# EAGLE design Driver Board (EAGLE 8.7.1)
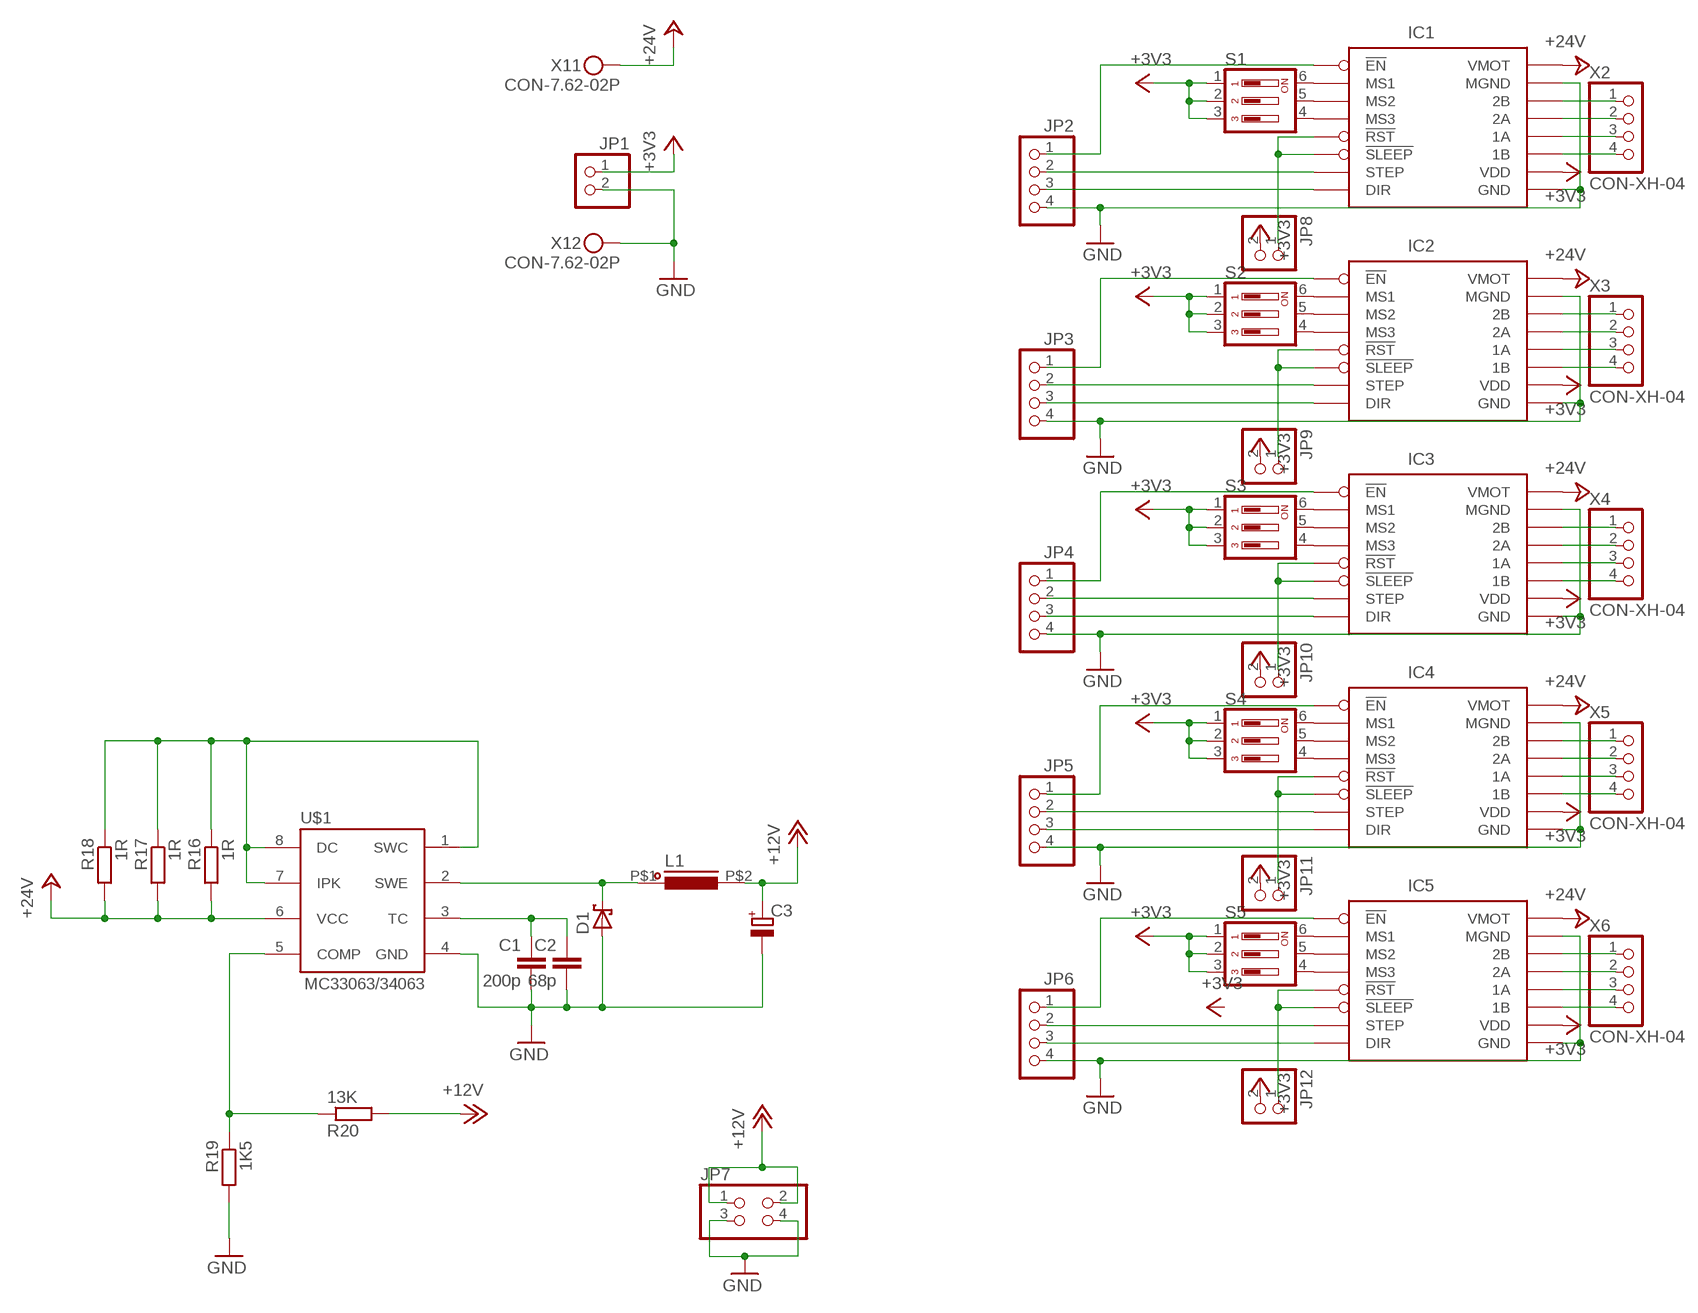
[diagram p0: schematic, sheet 1]

## Parts
C1  200p  CAP_0805  [C0805]
C2  68p  CAP_0805  [C0805]
C3  CAP-POL_E3.5-8  [E3,5-8]
D1  DIODE-SH_SMA  [DO214AC]
IC1  STEP-DRV  [DRV-BRK]
IC2  STEP-DRV  [DRV-BRK]
IC3  STEP-DRV  [DRV-BRK]
IC4  STEP-DRV  [DRV-BRK]
IC5  STEP-DRV  [DRV-BRK]
JP1  PINHD-1X2  [1X02]
JP2  PINHD-1X4  [1X04]
JP3  PINHD-1X4  [1X04]
JP4  PINHD-1X4  [1X04]
JP5  PINHD-1X4  [1X04]
JP6  PINHD-1X4  [1X04]
JP7  PINHD-2X2  [2X02]
JP8  PINHD-1X2  [1X02]
JP9  PINHD-1X2  [1X02]
JP10  PINHD-1X2  [1X02]
JP11  PINHD-1X2  [1X02]
JP12  PINHD-1X2  [1X02]
L1  INDUCTORCW68  [CW68]
R16  1R  R_0805  [R0805]
R17  1R  R_0805  [R0805]
R18  1R  R_0805  [R0805]
R19  1K5  R_0805  [R0805]
R20  13K  R_0805  [R0805]
S1  SW-DIP03S  [DIP03YL]
S2  SW-DIP03S  [DIP03YL]
S3  SW-DIP03S  [DIP03YL]
S4  SW-DIP03S  [DIP03YL]
S5  SW-DIP03S  [DIP03YL]
U$1  MC33063/MC34063P  [DIL08]
X1  CON-7.62-02P  [KF25C-7.62-02P-13]
X2  CON-XH-04  [XH-04]
X3  CON-XH-04  [XH-04]
X4  CON-XH-04  [XH-04]
X5  CON-XH-04  [XH-04]
X6  CON-XH-04  [XH-04]

## Nets
+3V3: IC1.P$10(VDD) IC2.P$10(VDD) IC3.P$10(VDD) IC4.P$10(VDD) IC5.P$10(VDD) JP1.1 JP8.2 JP9.2 JP10.2 JP11.2 JP12.2 S1.1 S1.2 S1.3 S2.1 S2.2 S2.3 S3.1 S3.2 S3.3 S4.1 S4.2 S4.3 S5.1 S5.2 S5.3
+12V: C3.+ JP7.1 JP7.2 L1.P$2 R20.2
+24V: IC1.P$16(VMOT) IC2.P$16(VMOT) IC3.P$16(VMOT) IC4.P$16(VMOT) IC5.P$16(VMOT) R16.2 R17.2 R18.2 U$1.6(VCC) X1.P$1
GND: C1.2 C2.2 C3.- D1.A IC1.P$9(GND) IC1.P$15(MGND) IC2.P$9(GND) IC2.P$15(MGND) IC3.P$9(GND) IC3.P$15(MGND) IC4.P$9(GND) IC4.P$15(MGND) IC5.P$9(GND) IC5.P$15(MGND) JP1.2 JP2.4 JP3.4 JP4.4 JP5.4 JP6.4 JP7.3 JP7.4 R19.2 U$1.4(GND) X1.P$2
N$1: IC1.P$1(!EN) JP2.1
N$2: IC1.P$7(STEP) JP2.2
N$3: IC1.P$8(DIR) JP2.3
N$4: IC1.P$14(2B) X2.1
N$5: IC2.P$8(DIR) JP3.3
N$6: IC2.P$7(STEP) JP3.2
N$7: IC2.P$1(!EN) JP3.1
N$8: IC1.P$13(2A) X2.2
N$9: IC3.P$8(DIR) JP4.3
N$10: IC3.P$7(STEP) JP4.2
N$11: IC3.P$1(!EN) JP4.1
N$12: IC1.P$12(1A) X2.3
N$13: IC1.P$11(1B) X2.4
N$14: IC4.P$8(DIR) JP5.3
N$15: IC4.P$7(STEP) JP5.2
N$16: IC4.P$1(!EN) JP5.1
N$17: IC2.P$14(2B) X3.1
N$18: IC5.P$8(DIR) JP6.3
N$19: IC5.P$7(STEP) JP6.2
N$20: IC5.P$1(!EN) JP6.1
N$21: IC2.P$13(2A) X3.2
N$22: IC2.P$12(1A) X3.3
N$23: IC2.P$11(1B) X3.4
N$24: IC3.P$14(2B) X4.1
N$25: IC3.P$13(2A) X4.2
N$26: IC3.P$12(1A) X4.3
N$27: IC3.P$11(1B) X4.4
N$28: IC4.P$14(2B) X5.1
N$29: IC4.P$13(2A) X5.2
N$30: IC4.P$12(1A) X5.3
N$31: IC4.P$11(1B) X5.4
N$32: IC5.P$14(2B) X6.1
N$33: IC5.P$13(2A) X6.2
N$34: IC5.P$12(1A) X6.3
N$35: IC5.P$11(1B) X6.4
N$36: IC1.P$4(MS3) S1.4
N$37: IC1.P$3(MS2) S1.5
N$38: IC1.P$2(MS1) S1.6
N$39: IC5.P$5(!RST) IC5.P$6(!SLEEP) JP12.1
N$40: IC4.P$5(!RST) IC4.P$6(!SLEEP) JP11.1
N$41: IC3.P$5(!RST) IC3.P$6(!SLEEP) JP10.1
N$42: IC2.P$5(!RST) IC2.P$6(!SLEEP) JP9.1
N$43: IC1.P$5(!RST) IC1.P$6(!SLEEP) JP8.1
N$44: IC2.P$4(MS3) S2.4
N$45: IC2.P$3(MS2) S2.5
N$46: IC2.P$2(MS1) S2.6
N$47: IC3.P$4(MS3) S3.4
N$48: IC3.P$3(MS2) S3.5
N$49: IC3.P$2(MS1) S3.6
N$50: IC4.P$4(MS3) S4.4
N$51: C1.1 C2.1 U$1.3(TC)
N$52: R16.1 R17.1 R18.1 U$1.1(SWC) U$1.7(IPK) U$1.8(DC)
N$53: IC4.P$3(MS2) S4.5
N$54: D1.C L1.P$1 U$1.2(SWE)
N$55: R19.1 R20.1 U$1.5(COMP)
N$56: IC4.P$2(MS1) S4.6
N$57: IC5.P$4(MS3) S5.4
N$58: IC5.P$3(MS2) S5.5
N$59: IC5.P$2(MS1) S5.6

## Library data of the parts
C1 C2 = Namenlos:CAP_
C3 = Namenlos:CAP-POL_
D1 = Namenlos:DIODE-SH_
IC1-IC5 = Namenlos:STEP-DRV
JP1 JP8-JP12 = pinhead:PINHD-1X2: PIN HEADER
JP2-JP6 = pinhead:PINHD-1X4: PIN HEADER
JP7 = pinhead:PINHD-2X2: PIN HEADER
L1 = Namenlos:INDUCTOR
R16-R20 = Namenlos:R_
S1-S5 = Namenlos:SW-DIP03S: DIL/CODE SWITCH; OC_FARNELL: unknown; OC_NEWARK: unknown
U$1 = adafruit:MC33063/MC34063: MC33063 and MC34063 Basic DC/DC converter with internal power-NPN transistor, 100KHz, 1.5A peak switch current. 3-40 input/output.
X1 = Namenlos:CON-7.62-02P
X2-X6 = Namenlos:CON-XH-04

## Board
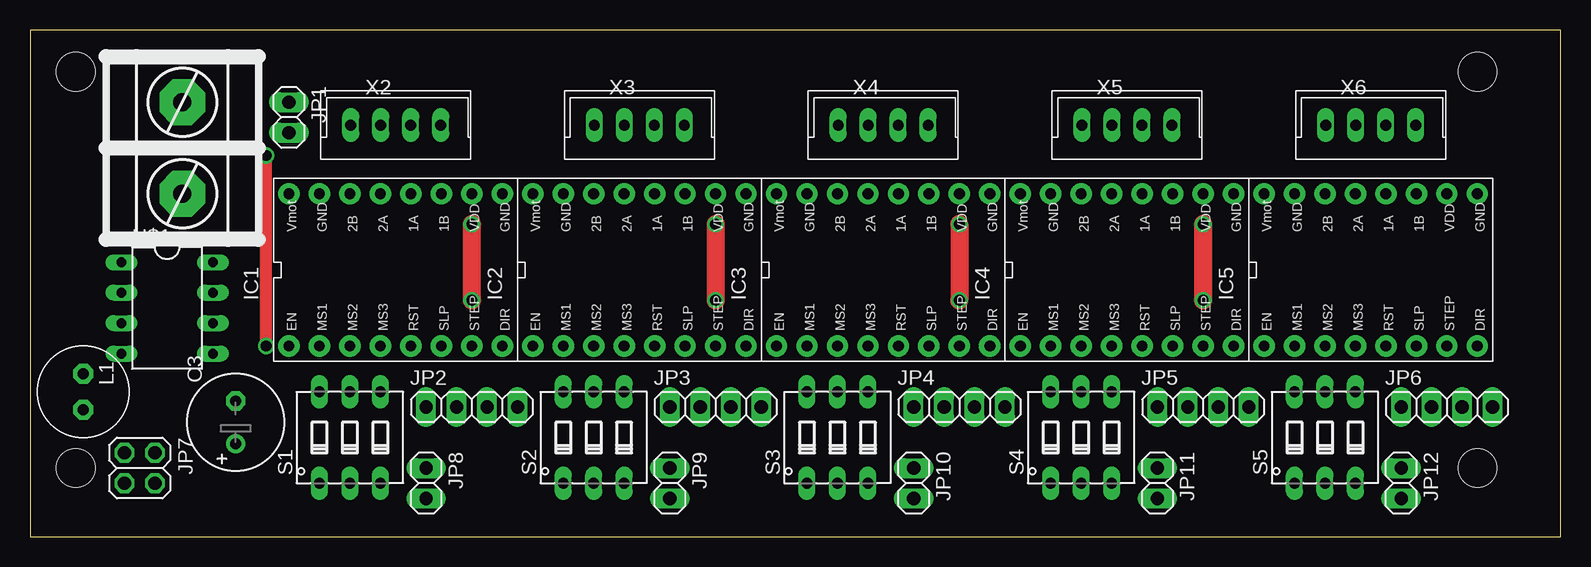
[diagram p1: board, top side]
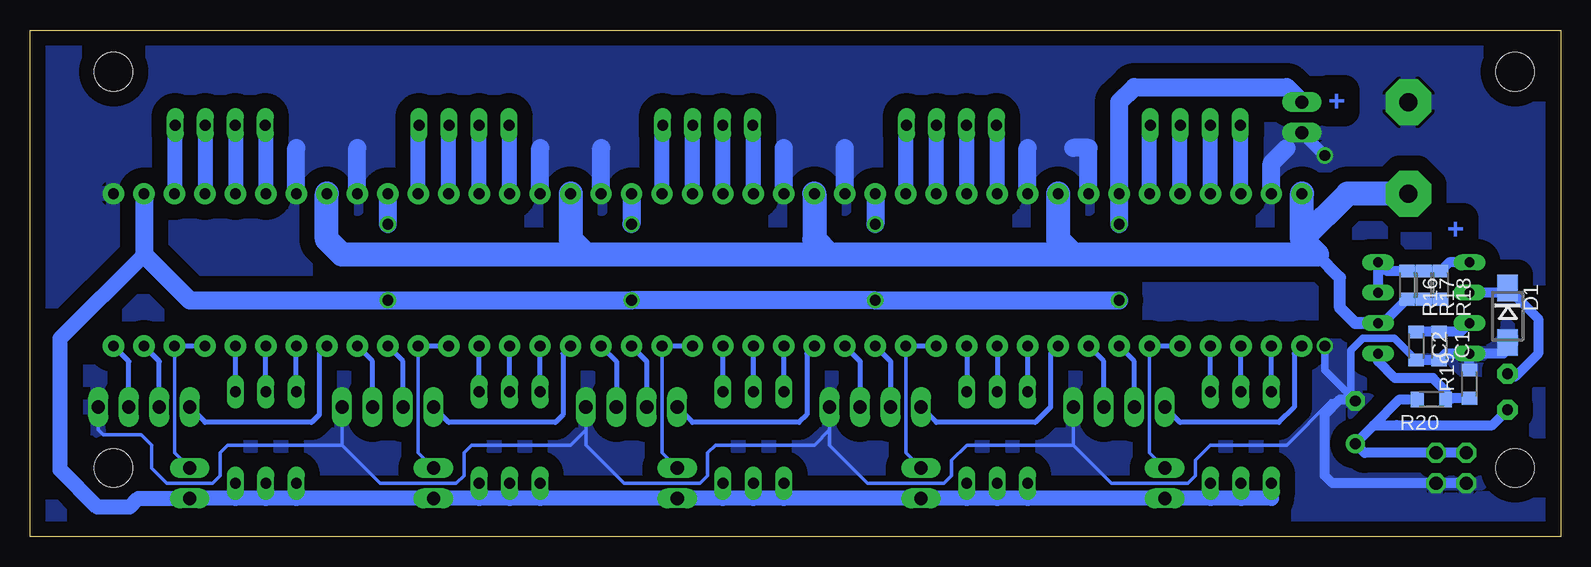
[diagram p2: board, bottom side, seen from below]

Size 127.61 x 42.22 mm. Coordinates in mm from the lower left corner, seen from the top.
Outline: 0,0 127.61,0 127.61,42.22 0,42.22 0,0
Copper layers (1*16): Top 0.035mm / dielectric 1.5mm / Bottom 0.035mm
Design rules "default": minimum track width 6mil, minimum drill 0.35mm, track to track 6mil, track to pad 6mil, pad to pad 6mil, via to via 6mil, smd to smd 6mil, copper to edge 40mil, drill to drill 6mil, minimum pad ring 10mil, minimum via ring 8mil, stop-mask expansion 4mil, vias tented up to drill 0mil, thermal gap 10mil
Holes 3.2 mm at 3.81,5.71 120.65,5.71 3.81,38.73 120.65,38.73

### Footprints (pad centres in the part's own frame; a part is rotated, then mirrored left to right if it is on the bottom)
C0805 = smd 1.05 x 1.3: 1 -1.175,0; 2 1.175,0
E3,5-8 = drill 0.9 pad 1.6: + -1.778,0 | drill 0.9 pad 1.6 octagon: - 1.778,0
DO214AC = smd 2.2 x 1.7: A 2.25,0; C -2.285,0
DRV-BRK = drill 0.9 pad 1.778: P$1 -8.89,-6.35; P$2 -6.35,-6.35; P$3 -3.81,-6.35; P$4 -1.27,-6.35; P$5 1.27,-6.35; P$6 3.81,-6.35; P$7 6.35,-6.35; P$8 8.89,-6.35; P$9 8.89,6.35; P$10 6.35,6.35; P$11 3.81,6.35; P$12 1.27,6.35; P$13 -1.27,6.35; P$14 -3.81,6.35; P$15 -6.35,6.35; P$16 -8.89,6.35
1X02 = drill 1.1 long: 1 -1.27,0; 2 1.27,0
1X04 = drill 1.1 long: 1 -3.81,0; 2 -1.27,0; 3 1.27,0; 4 3.81,0
2X02 = drill 1.1 octagon: 1 -1.27,-1.27; 2 -1.27,1.27; 3 1.27,-1.27; 4 1.27,1.27
CW68 = drill 0.9 pad 1.676 octagon: P$1 -1.5,0; P$2 1.5,0
R0805 = smd 1.05 x 1.3: 1 -1.175,0; 2 1.175,0
DIP03YL = drill 0.9 long: 1 -2.54,-3.81; 2 0,-3.81; 3 2.54,-3.81; 4 2.54,3.81; 5 0,3.81; 6 -2.54,3.81
DIL08 = drill 0.813 long: 1 -3.81,-3.81; 2 -1.27,-3.81; 3 1.27,-3.81; 4 3.81,-3.81; 5 3.81,3.81; 6 1.27,3.81; 7 -1.27,3.81; 8 -3.81,3.81
KF25C-7.62-02P-13 = drill 1.5 pad 3.81 octagon: P$1 -3.81,0; P$2 3.81,0
XH-04 = drill 0.9 long: 1 -3.75,0; 2 -1.25,0; 3 1.25,0; 4 3.75,0

### Placement (x,y rotation side)
C1  10.16,15.88 270 bottom
C2  12.06,15.88 270 bottom
C3  17.14,9.52 90 top
D1  4.45,18.41 270 bottom
IC1  30.48,22.22 0 top
IC2  50.8,22.22 0 top
IC3  71.12,22.22 0 top
IC4  91.44,22.22 0 top
IC5  111.76,22.22 0 top
JP1  21.59,34.92 270 top
JP2  36.83,10.79 0 top
JP3  57.15,10.79 0 top
JP4  77.47,10.79 0 top
JP5  97.79,10.79 0 top
JP6  118.11,10.79 0 top
JP7  9.14,5.71 270 top
JP8  33.02,4.44 270 top
JP9  53.34,4.44 270 top
JP10  73.66,4.44 270 top
JP11  93.98,4.44 270 top
JP12  114.3,4.44 270 top
L1  4.45,12.06 270 top
R16  12.83,20.95 270 bottom
R17  11.43,20.95 270 bottom
R18  10.03,20.95 270 bottom
R19  7.62,12.7 90 bottom
R20  10.79,11.43 180 bottom
S1  26.67,8.25 0 top
S2  46.99,8.25 0 top
S3  67.31,8.25 0 top
S4  87.63,8.25 0 top
S5  107.95,8.25 0 top
U$1  11.43,19.05 270 top
X1  12.7,32.38 90 top
X2  30.48,34.29 0 top
X3  50.8,34.29 0 top
X4  71.12,34.29 0 top
X5  91.44,34.29 0 top
X6  111.76,34.29 0 top

### Tracks (layer width: path | path; a pad name or v marks a point on that pad's centre or on a via)
+3V3  (via drill 0.9 pad 0.9)
  Top 1.5: v36.83,26.03 v36.83,19.68 | v57.15,26.03 v57.15,19.68 | v77.47,26.03 v77.47,19.68 | v97.79,26.03 v97.79,19.68
  Bottom 0.406: S1.1 24.13,3.17 | S1.2 26.67,3.17 | S1.3 29.21,3.17 | S2.1 44.45,3.17 | S2.2 46.99,3.17 | S2.3 49.53,3.17 | S3.1 64.77,3.17 | S3.2 67.31,3.17 | S3.3 69.85,3.17 | S4.1 85.09,3.17 | S4.2 87.63,3.17 | S4.3 90.17,3.17 | S5.1 105.41,3.17 | S5.2 107.95,3.17 | S5.3 110.49,3.17
  Bottom 1.27: 24.13,3.17 26.67,3.17 29.21,3.17 JP8.2 44.45,3.17 46.99,3.17 49.53,3.17 JP9.2 64.77,3.17 67.31,3.17 69.85,3.17 JP10.2 85.09,3.17 87.63,3.17 90.17,3.17 JP11.2 105.41,3.17 107.95,3.17 110.49,3.17 JP12.2 118.59,3.17 119.3,2.46 122,2.46 125.09,5.56 125.09,16.51 118.11,23.49
  Bottom 1.5: v36.83,26.03 IC1.P$10 36.83,36.19 35.56,37.47 22.86,37.47 JP1.1 | IC2.P$10 v57.15,26.03 | IC3.P$10 v77.47,26.03 | IC4.P$10 v97.79,26.03 | IC5.P$10 118.11,23.49 114.3,19.68 v97.79,19.68 v77.47,19.68 v57.15,19.68 v36.83,19.68
+12V
  Bottom 0.813: JP7.1 JP7.2 16.38,6.98 C3.+ 15.6,9.29 | L1.P$2 5.71,9.29 13.69,9.29 15.6,9.29 | 15.6,9.29 13.46,11.43 R20.2
+24V
  Bottom 0.813: U$1.6 14.83,17.78 R16.2 R17.2 R18.2
  Bottom 1.016: U$1.6 17.14,17.78 18.41,19.05 18.41,21.59 20.32,23.49
  Bottom 2: 60.96,23.49 81.28,23.49 | 40.64,23.49 60.96,23.49 | 40.64,23.49 20.32,23.49 21.59,24.76 | 81.28,23.49 101.6,23.49 102.87,24.76 IC5.P$16 | IC4.P$16 82.55,24.76 81.28,23.49 | IC3.P$16 62.23,24.76 60.96,23.49 | IC2.P$16 41.91,24.76 40.64,23.49 | 21.59,24.76 IC1.P$16 | X1.P$1 17.78,28.58 21.59,24.76
GND  (via drill 0.9)
  Top 1.016: v19.68,15.88 v19.68,31.75
  Bottom 0.305: C3.- 19.18,11.3 22.86,7.62 29.21,7.62 30.48,6.35 30.48,5.08 31.11,4.44 37.47,4.44 40.64,7.62 | 40.64,7.62 JP2.4 | 40.64,7.62 49.53,7.62 50.8,6.35 50.8,5.08 51.44,4.44 57.78,4.44 60.96,7.62 60.96,8.89 | 60.96,8.89 JP3.4 | 60.96,8.89 62.23,7.62 70.48,7.62 71.12,6.98 71.12,5.08 71.75,4.44 78.11,4.44 81.28,7.62 81.28,8.89 | 81.28,8.89 JP4.4 | 81.28,8.89 82.55,7.62 90.81,7.62 91.44,6.98 91.44,5.08 92.08,4.44 98.42,4.44 101.6,7.62 | 101.6,7.62 JP5.4 | 101.6,7.62 111.12,7.62 111.76,6.98 111.76,5.08 112.39,4.44 116.2,4.44 117.47,5.71 117.47,7.62 118.34,8.48 121.51,8.48 121.92,8.89 JP6.4
  Bottom 0.61: C2.2 13.88,16.51 16.51,16.51 17.5,15.52 17.5,11.66 C3.- 19.68,13.84 v19.68,15.88
  Bottom 0.813: D1.A 4.79,15.24 U$1.4 | R19.2 U$1.4 | C2.2 C1.2 9.62,15.24 U$1.4 | JP7.3 JP7.4 19.05,4.44 19.68,5.08 19.68,10.16 18.41,11.43 17.27,11.43 C3.-
  Bottom 1.016: 19.68,15.75 v19.68,15.88 | v19.68,31.75 JP1.2
  Bottom 1.5: IC1.P$15 24.13,31.11 22.86,32.38 | IC1.P$9 39.37,32.38 40.64,32.38 | IC2.P$15 44.45,32.38 | IC2.P$9 59.69,32.38 | IC3.P$15 64.77,32.38 | IC3.P$9 80.01,32.38 | IC4.P$15 85.09,32.38 | IC4.P$9 100.33,32.38 | IC5.P$15 105.41,32.38
  pour Bottom (isolate 1.27, rank 2): 0,0 0,42.55 127.64,42.55 127.64,0
N$1
  Bottom 0.406: IC1.P$1 22.23,15.24 22.23,10.79 23.5,9.52 31.75,9.52 JP2.1
N$2
  Bottom 0.406: JP2.2 35.56,14.6 IC1.P$7
N$3
  Bottom 0.406: JP2.3 38.1,14.6 IC1.P$8
N$4
  Bottom 1.27: IC1.P$14 26.67,34.23 X2.1
N$5
  Bottom 0.406: IC2.P$8 58.42,14.6 JP3.3
N$6
  Bottom 0.406: IC2.P$7 55.88,14.6 JP3.2
N$7
  Bottom 0.406: IC2.P$1 42.55,15.24 42.55,10.79 43.81,9.52 52.07,9.52 JP3.1
N$8
  Bottom 1.27: IC1.P$13 29.21,34.27 X2.2
N$9
  Bottom 0.406: IC3.P$8 78.74,14.6 JP4.3
N$10
  Bottom 0.406: IC3.P$7 76.2,14.6 JP4.2
N$11
  Bottom 0.406: IC3.P$1 62.87,15.24 62.87,10.16 63.5,9.52 72.39,9.52 JP4.1
N$12
  Bottom 1.27: IC1.P$12 31.75,34.27 X2.3
N$13
  Bottom 1.27: IC1.P$11 34.29,34.23 X2.4
N$14
  Bottom 0.406: JP5.3 99.06,14.6 IC4.P$8
N$15
  Bottom 0.406: JP5.2 96.52,14.6 IC4.P$7
N$16
  Bottom 0.406: IC4.P$1 83.19,15.24 83.19,10.16 83.82,9.52 92.71,9.52 JP5.1
N$17
  Bottom 1.27: IC2.P$14 46.99,34.23 X3.1
N$18
  Bottom 0.406: JP6.3 119.38,14.6 IC5.P$8
N$19
  Bottom 0.406: JP6.2 116.84,14.6 IC5.P$7
N$20
  Bottom 0.406: IC5.P$1 103.5,15.24 103.5,10.16 104.14,9.52 113.03,9.52 JP6.1
N$21
  Bottom 1.27: IC2.P$13 49.53,34.27 X3.2
N$22
  Bottom 1.27: IC2.P$12 52.07,34.27 X3.3
N$23
  Bottom 1.27: IC2.P$11 54.61,34.23 X3.4
N$24
  Bottom 1.27: IC3.P$14 67.31,34.23 X4.1
N$25
  Bottom 1.27: IC3.P$13 69.85,34.27 X4.2
N$26
  Bottom 1.27: IC3.P$12 72.39,34.27 X4.3
N$27
  Bottom 1.27: IC3.P$11 74.93,34.23 X4.4
N$28
  Bottom 1.27: IC4.P$14 87.63,34.23 X5.1
N$29
  Bottom 1.27: IC4.P$13 90.17,34.27 X5.2
N$30
  Bottom 1.27: IC4.P$12 92.71,34.27 X5.3
N$31
  Bottom 1.27: IC4.P$11 95.25,34.23 X5.4
N$32
  Bottom 1.27: X6.1 107.95,34.23 IC5.P$14
N$33
  Bottom 1.27: X6.2 110.49,34.27 IC5.P$13
N$34
  Bottom 1.27: X6.3 113.03,34.27 IC5.P$12
N$35
  Bottom 1.27: X6.4 115.57,34.23 IC5.P$11
N$36
  Bottom 0.406: S1.4 IC1.P$4
N$37
  Bottom 0.406: S1.5 IC1.P$3
N$38
  Bottom 0.406: S1.6 IC1.P$2
N$39
  Bottom 0.305: IC5.P$6 115.57,6.98 JP12.1
  Bottom 0.406: IC5.P$5 IC5.P$6
N$40
  Bottom 0.305: IC4.P$6 95.25,6.98 JP11.1
  Bottom 0.406: IC4.P$5 IC4.P$6
N$41
  Bottom 0.305: IC3.P$6 74.93,6.98 JP10.1
  Bottom 0.406: IC3.P$5 IC3.P$6
N$42
  Bottom 0.305: IC2.P$6 54.61,6.98 JP9.1
  Bottom 0.406: IC2.P$5 IC2.P$6
N$43
  Bottom 0.305: IC1.P$6 34.29,6.98 JP8.1
  Bottom 0.406: IC1.P$5 IC1.P$6
N$44
  Bottom 0.406: IC2.P$4 S2.4
N$45
  Bottom 0.406: IC2.P$3 S2.5
N$46
  Bottom 0.406: IC2.P$2 S2.6
N$47
  Bottom 0.406: S3.4 IC3.P$4
N$48
  Bottom 0.406: S3.5 IC3.P$3
N$49
  Bottom 0.406: S3.6 IC3.P$2
N$50
  Bottom 0.406: S4.4 IC4.P$4
N$51
  Bottom 0.813: U$1.3 8.35,17.05 C1.1 C2.1
N$52
  Bottom 0.813: U$1.1 9.3,22.86 R18.1 R17.1 R16.1 14.51,22.13 U$1.8 U$1.7
N$53
  Bottom 0.406: S4.5 IC4.P$3
N$54
  Bottom 0.813: U$1.2 5.33,20.32 D1.C 1.91,18.16 1.91,15.24 3.81,13.33 4.21,13.33 L1.P$1
N$55
  Bottom 0.813: R19.1 9.08,11.52 R20.1 9.62,12.16 10.67,13.21 13.84,13.21 15.24,14.6 U$1.5
N$56
  Bottom 0.406: S4.6 IC4.P$2
N$57
  Bottom 0.406: S5.4 IC5.P$4
N$58
  Bottom 0.406: S5.5 IC5.P$3
N$59
  Bottom 0.406: S5.6 IC5.P$2

### Text on the board
Bottom: + | +